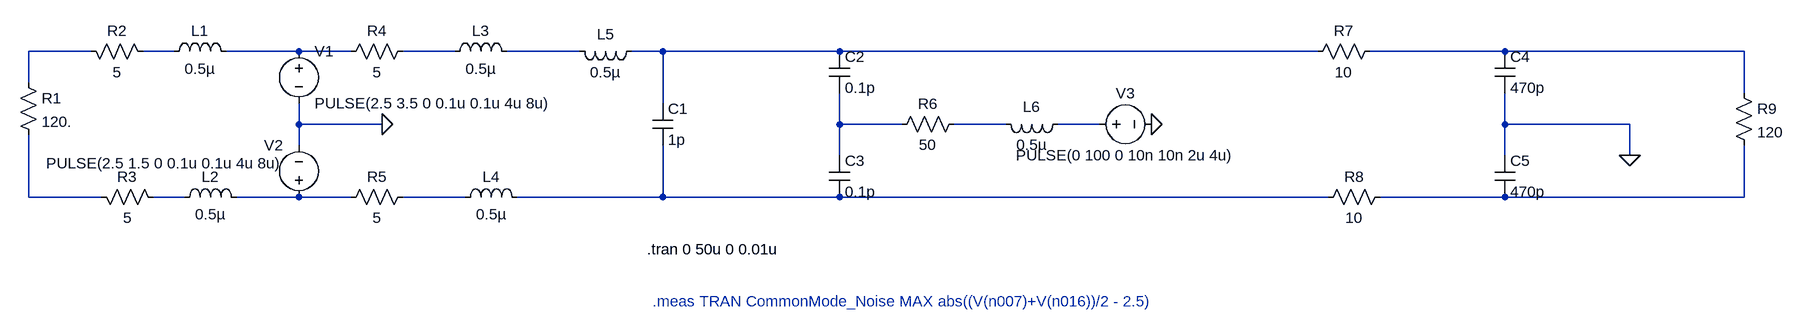
[diagram p0: schematic RC_Filter_ps2.asc]
RC_Filter_ps2.asc, the LTspice schematic file:
Version 4.1
SHEET 1 1748 680
WIRE -864 -80 -960 -80
WIRE -736 -80 -784 -80
WIRE -544 -80 -656 -80
WIRE -464 -80 -544 -80
WIRE -304 -80 -384 -80
WIRE -112 -80 -224 -80
WIRE 16 -80 -32 -80
WIRE 288 -80 16 -80
WIRE 1024 -80 288 -80
WIRE 1312 -80 1104 -80
WIRE 1680 -80 1312 -80
WIRE -960 -32 -960 -80
WIRE 1680 -16 1680 -80
WIRE 16 0 16 -80
WIRE -544 32 -544 0
WIRE -416 32 -544 32
WIRE 288 32 288 -16
WIRE 384 32 288 32
WIRE 544 32 464 32
WIRE 688 32 624 32
WIRE 1312 32 1312 -16
WIRE 1504 32 1312 32
WIRE -544 64 -544 32
WIRE 288 80 288 32
WIRE 1312 80 1312 32
WIRE 1504 80 1504 32
WIRE -960 144 -960 48
WIRE -848 144 -960 144
WIRE -720 144 -768 144
WIRE -544 144 -640 144
WIRE -464 144 -544 144
WIRE -288 144 -384 144
WIRE 16 144 16 64
WIRE 16 144 -208 144
WIRE 288 144 16 144
WIRE 1040 144 288 144
WIRE 1312 144 1120 144
WIRE 1680 144 1680 64
WIRE 1680 144 1312 144
FLAG 768 32 0
FLAG -416 32 0
FLAG 1504 80 0
SYMBOL res -976 -48 R0
SYMATTR InstName R1
SYMATTR Value 120.
SYMBOL res -880 -96 M90
WINDOW 0 0 56 VBottom 2
WINDOW 3 32 56 VTop 2
SYMATTR InstName R2
SYMATTR Value 5
SYMBOL res -864 128 M90
WINDOW 0 0 56 VBottom 2
WINDOW 3 32 56 VTop 2
SYMATTR InstName R3
SYMATTR Value 5
SYMBOL ind -640 -64 M270
WINDOW 0 32 56 VTop 2
WINDOW 3 5 56 VBottom 2
SYMATTR InstName L1
SYMATTR Value 0.5µ
SYMATTR SpiceLine Rser=1m
SYMBOL ind -624 160 M270
WINDOW 0 32 56 VTop 2
WINDOW 3 5 56 VBottom 2
SYMATTR InstName L2
SYMATTR Value 0.5µ
SYMATTR SpiceLine Rser=1m
SYMBOL voltage -544 -96 R0
WINDOW 123 0 0 Left 0
WINDOW 39 0 0 Left 0
SYMATTR InstName V1
SYMATTR Value PULSE(2.5 3.5 0 0.1u 0.1u 4u 8u)
SYMBOL voltage -544 160 R180
WINDOW 0 24 96 Left 2
WINDOW 3 24 68 Left 2
WINDOW 123 0 0 Left 0
WINDOW 39 0 0 Left 0
SYMATTR InstName V2
SYMATTR Value PULSE(2.5 1.5 0 0.1u 0.1u 4u 8u)
SYMBOL res -368 -96 R90
WINDOW 0 0 56 VBottom 2
WINDOW 3 32 56 VTop 2
SYMATTR InstName R4
SYMATTR Value 5
SYMBOL res -368 128 R90
WINDOW 0 0 56 VBottom 2
WINDOW 3 32 56 VTop 2
SYMATTR InstName R5
SYMATTR Value 5
SYMBOL ind -320 -64 R270
WINDOW 0 32 56 VTop 2
WINDOW 3 5 56 VBottom 2
SYMATTR InstName L3
SYMATTR Value 0.5µ
SYMATTR SpiceLine Rser=1m
SYMBOL ind -304 160 R270
WINDOW 0 32 56 VTop 2
WINDOW 3 5 56 VBottom 2
SYMATTR InstName L4
SYMATTR Value 0.5µ
SYMATTR SpiceLine Rser=1m
SYMBOL ind -16 -96 R90
WINDOW 0 5 56 VBottom 2
WINDOW 3 32 56 VTop 2
SYMATTR InstName L5
SYMATTR Value 0.5µ
SYMATTR SpiceLine Rser=1m
SYMBOL cap 0 0 R0
SYMATTR InstName C1
SYMATTR Value 1p
SYMBOL cap 272 -80 R0
SYMATTR InstName C2
SYMATTR Value 0.1p
SYMBOL cap 272 80 R0
SYMATTR InstName C3
SYMATTR Value 0.1p
SYMBOL res 480 16 R90
WINDOW 0 0 56 VBottom 2
WINDOW 3 32 56 VTop 2
SYMATTR InstName R6
SYMATTR Value 50
SYMBOL voltage 672 32 R270
WINDOW 0 32 56 VTop 2
WINDOW 3 -32 56 VBottom 2
WINDOW 123 0 0 Left 0
WINDOW 39 0 0 Left 0
SYMATTR InstName V3
SYMATTR Value PULSE(0 100 0 10n 10n 2u 4u)
SYMBOL ind 640 16 R90
WINDOW 0 5 56 VBottom 2
WINDOW 3 32 56 VTop 2
SYMATTR InstName L6
SYMATTR Value 0.5µ
SYMATTR SpiceLine Rser=1m
SYMBOL res 1120 -96 R90
WINDOW 0 0 56 VBottom 2
WINDOW 3 32 56 VTop 2
SYMATTR InstName R7
SYMATTR Value 10
SYMBOL res 1136 128 R90
WINDOW 0 0 56 VBottom 2
WINDOW 3 32 56 VTop 2
SYMATTR InstName R8
SYMATTR Value 10
SYMBOL cap 1296 -80 R0
SYMATTR InstName C4
SYMATTR Value 470p
SYMBOL cap 1296 80 R0
SYMATTR InstName C5
SYMATTR Value 470p
SYMBOL res 1664 -32 R0
SYMATTR InstName R9
SYMATTR Value 120
TEXT -8 224 Left 2 !.tran 0 50u 0 0.01u
TEXT 0 304 Left 2 ;.meas TRAN CommonMode_Noise MAX abs((V(n007)+V(n016))/2 - 2.5)

The netlist it stands for:
* RC_Filter_ps2.asc
R1 N001 N011 120.
R2 N001 N002 5
R3 N011 N012 5
L1 N003 N002 0.5µ Rser=1m
L2 N013 N012 0.5µ Rser=1m
V1 N003 0 PULSE(2.5 3.5 0 0.1u 0.1u 4u 8u)
V2 N013 0 PULSE(2.5 1.5 0 0.1u 0.1u 4u 8u)
R4 N004 N003 5
R5 N014 N013 5
L3 N004 N005 0.5µ Rser=1m
L4 N014 N015 0.5µ Rser=1m
L5 N006 N005 0.5µ Rser=1m
C1 N006 N015 1p
C2 N006 N008 0.1p
C3 N008 N015 0.1p
R6 N009 N008 50
V3 N010 0 PULSE(0 100 0 10n 10n 2u 4u)
L6 N010 N009 0.5µ Rser=1m
R7 N007 N006 10
R8 N016 N015 10
C4 N007 0 470p
C5 0 N016 470p
R9 N007 N016 120
.tran 0 50u 0 0.01u
* .meas TRAN CommonMode_Noise MAX abs((V(n007)+V(n016))/2 - 2.5)
.backanno
.end